# Altium schematic sheet A_conn_1P25D.SchDoc
size A; SheetNumber: 9; SheetTotal: 17
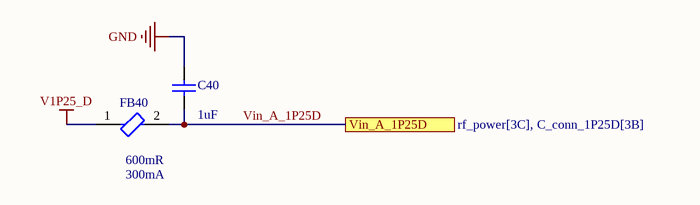
[diagram p0: A_conn_1P25D.SchDoc]

## Parts
C40  value 1uF  [CAPC2013X145X50LL20T25]  (hidden comment: C0805C105K4PACTU)
FB40  DC Resistance-Max: 600mR  Max DC Current: 300mA  [FP-BLM15-0_05-MFG]  (hidden comment: BLM15AG601SN1D)

## Ports
Vin_A_1P25D (see rf_power[3C], C_conn_1P25D[3B])

## Nets
GND: C40.2
V1P25_D: FB40.1
Vin_A_1P25D: C40.1 FB40.2 ; port Vin_A_1P25D

## Library data of the parts
C40 = CMP-1036-04746-2: Manufacturer: Kemet; Part Number: C0805C105K4PACTU
FB40 = CMP-0686-00187-4: Chip Ferrite Bead, 0402, 600Ω @ 100MHz, 0.52Ω, 25%, 300mA; Number of Lines: 1; DC Resistance (DCR): 520mR; Shielding: Unshielded; Impedance: 600R; Material: Steel; Frequency: 100MHz; Lead Free: Lead Free; Test Frequency: 100MHz; Depth: 0.55mm; Length: 1mm; Case Code (Imperial): 0402; Packaging: Tape and Reel; Height: 0.5mm; Max Operating Temperature: 125°C; Military Standard: Not; REACH SVHC: No SVHC; Case Code (Metric): 1005; Series: BLM15AG_SN; Core Material: Ferrite; Termination: SMD/SMT; DC Current: 300mA; Package Quantity: 10000; Width: 0.5mm; RoHS Compliant: Yes; Min Operating Temperature: -55°C; Current Rating: 300mA; Case/Package: 0402; Number of Pins: 2; Radiation Hardening: No; Tolerance: 25%; Number of Circuits: 1; Max Current Rating: 300mA